# EAGLE schematic PCB-TCH-CON (EAGLE 6.5.0)
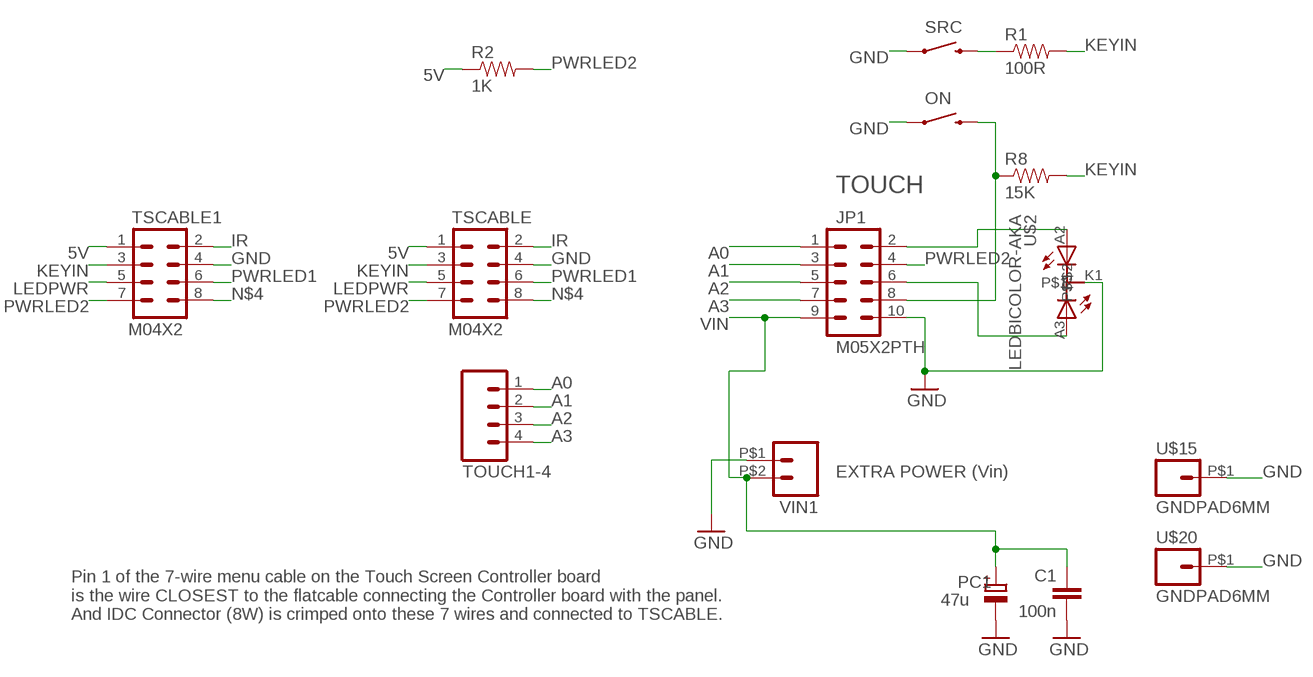
[diagram p0: schematic, sheet 1]

## Parts
C1  100n  C-EU0603-RND  [C0603-ROUND]
JP1  M05X2PTH  [AVR_ICSP]
ON  SWITCH-MOMENTARY-2  [TACTILE_SWITCH_TALL]
PC1  47u  CPOL-EUD  [PANASONIC_D]
R1  100R  RESISTOR0603-RES  [0603-RES]
R2  1K  RESISTOR0603-RES  [0603-RES]
R8  15K  RESISTOR0603-RES  [0603-RES]
SRC  SWITCH-MOMENTARY-2  [TACTILE_SWITCH_TALL]
TOUCH1-4  M04PTH  [1X04]
TSCABLE  M04X2  [2X4]
TSCABLE1  M04X2  [2X4]
U$2  LEDBICOLOR-AKA  [LED5MM-BICOLOR]
U$15  GNDPAD6MM  [3.2MMPAD6MM]
U$20  GNDPAD6MM  [3.2MMPAD6MM]
VIN1  M02PTH2  [1X02_BIG]

## Nets
5V [Power]: R2.1 TSCABLE1.1 TSCABLE.1
A0: JP1.1 TOUCH1-4.1
A1: JP1.3 TOUCH1-4.2
A2: JP1.5 TOUCH1-4.3
A3: JP1.7 TOUCH1-4.4
GND [Power]: C1.2 JP1.10 ON.A2 PC1.- SRC.A2 TSCABLE1.4 TSCABLE.4 U$2.K1 U$15.P$1 U$20.P$1 VIN1.P$1
IR: TSCABLE1.2 TSCABLE.2
KEYIN: R1.2 R8.2 TSCABLE1.3 TSCABLE.3
LEDPWR: TSCABLE1.5 TSCABLE.5
N$1: JP1.2 U$2.A2
N$2: JP1.6 U$2.A3
N$4: TSCABLE1.8 TSCABLE.8
N$6: R1.1 SRC.B2
N$11: JP1.8 ON.B2 R8.1
PWRLED1: TSCABLE1.6 TSCABLE.6
PWRLED2: JP1.4 R2.2 TSCABLE1.7 TSCABLE.7
VIN [Power]: C1.1 JP1.9 PC1.+ VIN1.P$2

## Notes on the sheet
- TOUCH
- EXTRA POWER (Vin)
- Pin 1 of the 7-wire menu cable on the Touch Screen Controller board
  is the wire CLOSEST to the flatcable connecting the Controller board with the panel.
  And IDC Connector (8W) is crimped onto these 7 wires and connected to TSCABLE.

## Library data of the parts
C1 = SmartPrj:C-EU: CAPACITOR, European symbol
JP1 = SparkFun:M05X2: Header 5x2 Standard 10-pin dual row 0.1" header. Commonly used with AVR-ISP. Use with Spark Fun Electronics SKU: PRT-00778
ON SRC = SparkFun:SWITCH-MOMENTARY-2
PC1 = rcl:CPOL-EU: POLARIZED CAPACITOR, European symbol
R1 R2 R8 = SparkFun:RESISTOR: Resistor Basic schematic elements and footprints for 0603, 1206, and PTH resistors.
TOUCH1-4 = SparkFun:M04: Header 4 Standard 4-pin 0.1" header. Use with straight break away headers (SKU : PRT-00116), right angle break away headers (PRT-00553), swiss pins (PRT-00743), machine pins (PRT-00117), and female headers (PRT-00115). Molex polarized connector foot print use with SKU : PRT-08231 with associated crimp pins and housings. 1MM SMD Version SKU: PRT-10208
TSCABLE TSCABLE1 = SparkFun:M04X2
U$2 = SKAARHOJ:LEDBICOLOR-AKA
U$15 U$20 = SKAARHOJ:GNDPAD
VIN1 = SparkFun:M02: Header 2 Standard 2-pin 0.1" header. Use with straight break away headers (SKU : PRT-00116), right angle break away headers (PRT-00553), swiss pins (PRT-00743), machine pins (PRT-00117), and female headers (PRT-00115). Molex polarized connector foot print use with SKU : PRT-08233 with associated crimp pins and housings.

## Net classes
0 default: width 0.203 mm, drill 0.61 mm, clearance 0.203 mm
1 Power: width 0.61 mm, drill 0.61 mm, clearance 0.305 mm